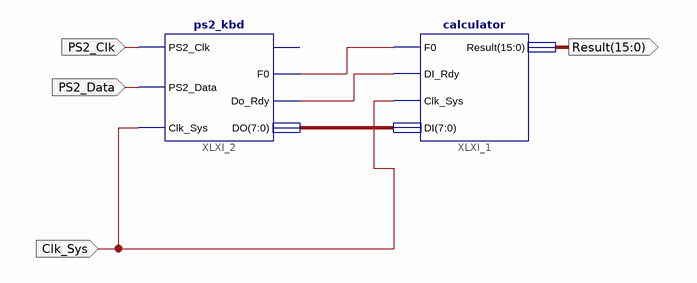
[diagram p0: schematic sheet 1]
// Xilinx ISE schematic circuit.sch (spartan3e) as structural Verilog: 2 symbols, 4 ports
module circuit (
  input  Clk_Sys,
  input  PS2_Data,
  input  PS2_Clk,
  output [15:0] Result
);

  wire DO_Rdy, F0;
  wire [7:0] DO;

  calculator XLXI_1 (.F0(F0), .DI_Rdy(DO_Rdy), .Clk_Sys(Clk_Sys), .DI(DO), .Result(Result));
  ps2_kbd XLXI_2 (
    .PS2_Clk(PS2_Clk), .PS2_Data(PS2_Data), .Clk_Sys(Clk_Sys), .F0(F0), .Do_Rdy(DO_Rdy), .DO(DO));  // open: E0
endmodule
